# EAGLE schematic Digital & Analog Startup Board (EAGLE 6.3)
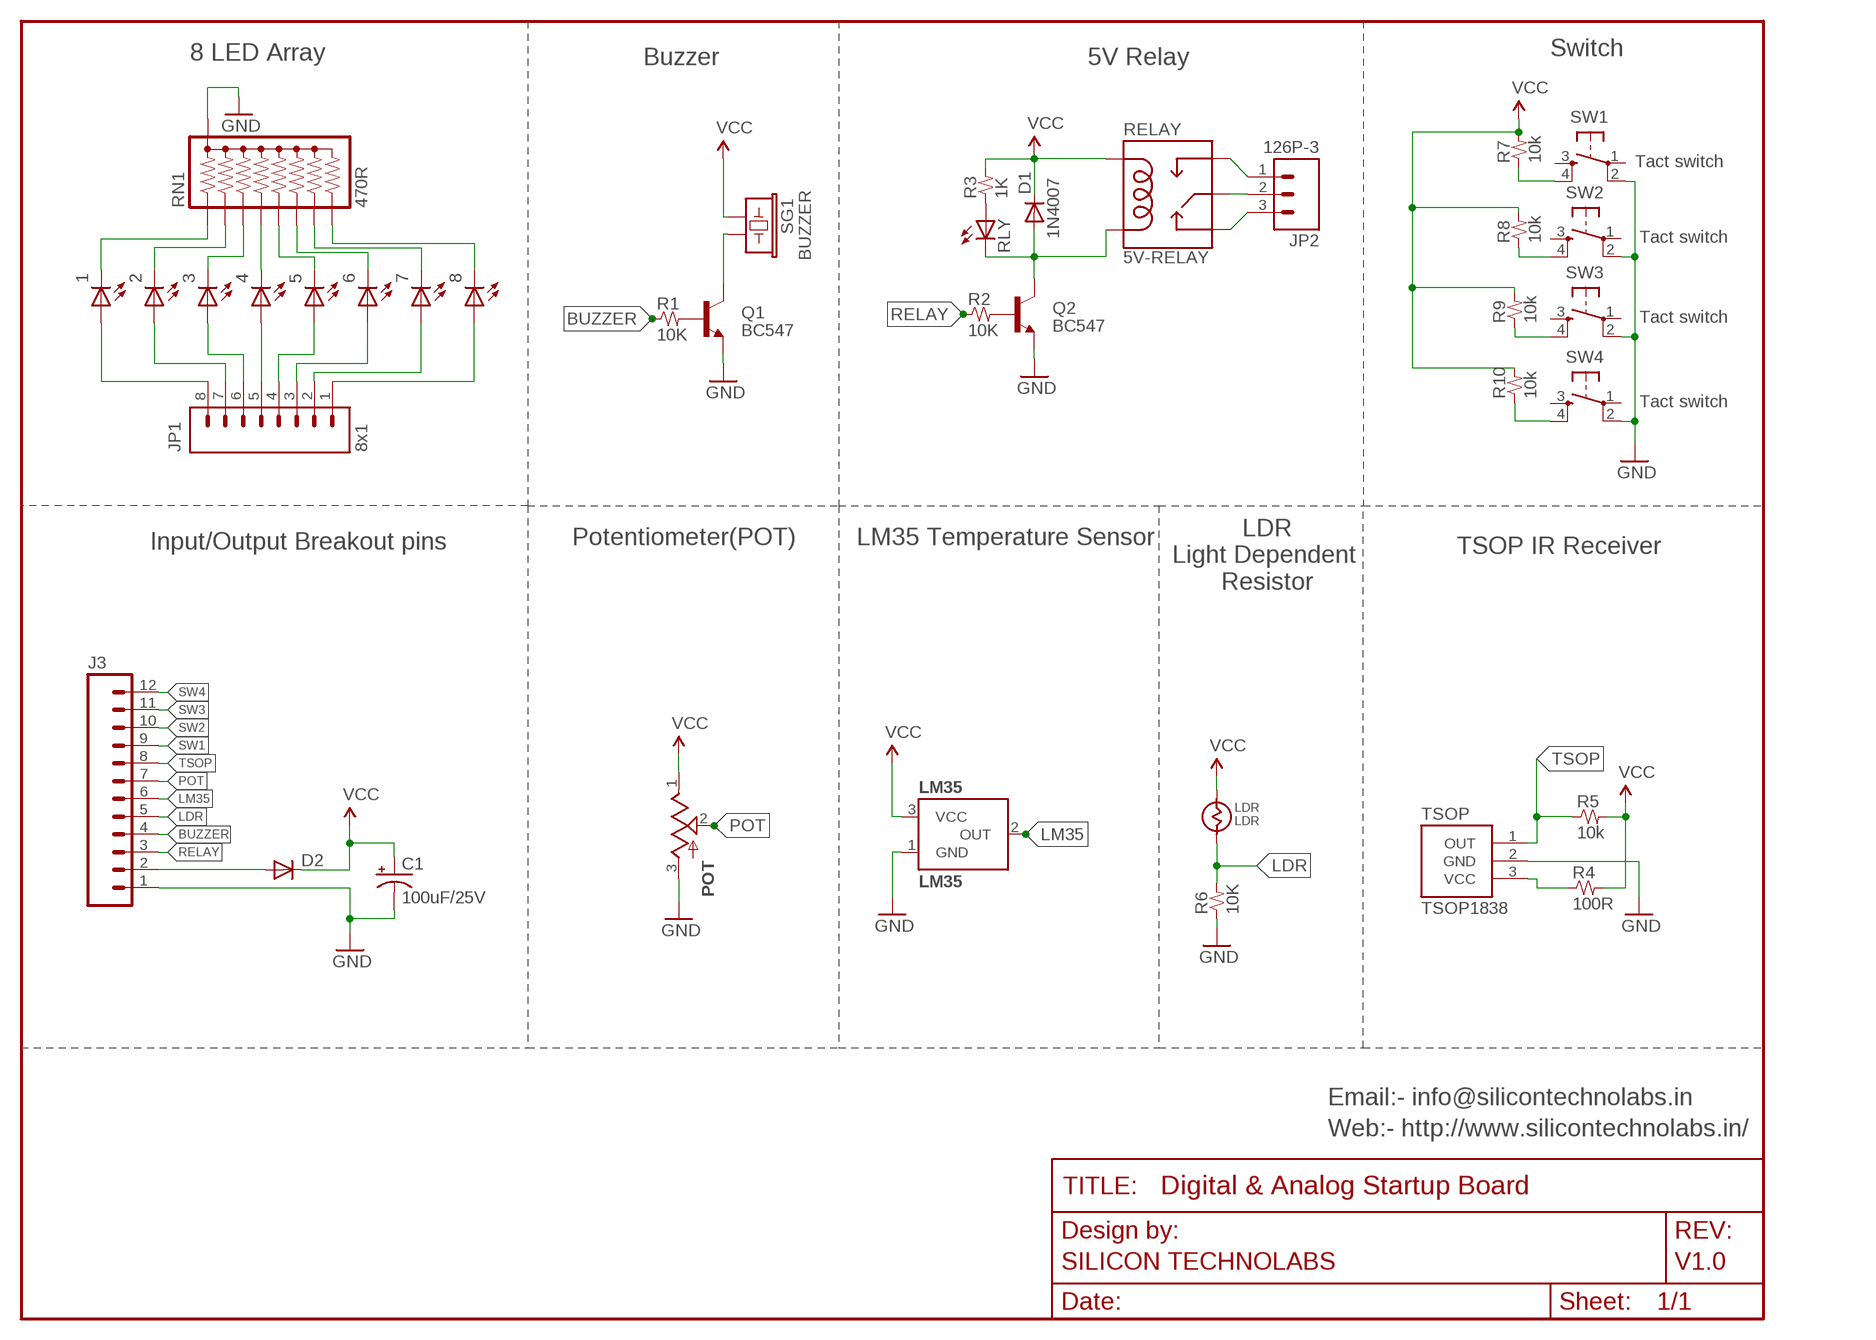
[diagram p0: schematic, sheet 1]

## Parts
1  LED3MM  [3MM]
2  LED3MM  [3MM]
3  LED3MM  [3MM]
4  LED3MM  [3MM]
5  LED3MM  [3MM]
5V-RELAY  RELAY  RELAYPTH5  [RELAY-LEONE]
6  LED3MM  [3MM]
7  LED3MM  [3MM]
8  LED3MM  [3MM]
C1  100uF/25V  CPOL100/25  [CPOL-RADIAL-100UF-25V]
D1  1N4007  [DIODE-1N4007]
D2  1N4007  [DIODE-1N4007]
J3  M12MACHINE-PIN_LOCK  [1X12_MACHINE-PIN-HEADER_LOCK.004]
JP1  8x1  M08  [1X08_LOCK]
JP2  126P-3  M03S  [1X03_SCREWTERM]
LDR  LDR  [LDR]
LM35  LM35  [TO-92]
POT  POTCH  [POT-CH]
Q1  BC547  [TO-92]
Q2  BC547  [TO-92]
R1  10K  RESISTOR-PTH-1/4W  [AXIAL-0.4]
R2  10K  RESISTOR-PTH-1/4W  [AXIAL-0.4]
R3  1K  RESISTOR-PTH-1/4W  [AXIAL-0.4]
R4  100R  RESISTOR-PTH-1/4W  [AXIAL-0.4]
R5  10k  RESISTOR-PTH-1/4W  [AXIAL-0.4]
R6  10K  RESISTOR-PTH-1/4W  [AXIAL-0.4]
R7  10k  RESISTOR-PTH-1/4W  [AXIAL-0.4]
R8  10k  RESISTOR-PTH-1/4W  [AXIAL-0.4]
R9  10k  RESISTOR-PTH-1/4W  [AXIAL-0.4]
R10  10k  RESISTOR-PTH-1/4W  [AXIAL-0.4]
RLY  LED3MM  [3MM]
RN1  470R  RPACK8  [RPACK-SIP-PTH-8-LP]
SG1  BUZZER  BUZZERPTH  [BUZZER-12MM]
SW1  Tact switch  TACTILE-SWITCH-5MM  [TACTILE-PTH]
SW2  Tact switch  TACTILE-SWITCH-5MM  [TACTILE-PTH]
SW3  Tact switch  TACTILE-SWITCH-5MM  [TACTILE-PTH]
SW4  Tact switch  TACTILE-SWITCH-5MM  [TACTILE-PTH]
TSOP  TSOP1838  BRM-2A18RA  [BRM-2508]

## Nets
BUZZER: J3.4 R1.P$1
COM: 5V-RELAY.C(MAIN) JP2.2
GND: C1.2(-) J3.1 LM35.1(GND) POT.3 Q1.1(E) Q2.1(E) R6.P$1 RN1.P$1 SW1.2 SW2.2 SW3.2 SW4.2 TSOP.2(GND)
LDR: J3.5 LDR.2 R6.P$2
LM35: J3.6 LM35.2(OUT)
N$1: 4.K(C) RN1.P$5
N$2: 1.K(C) RN1.P$2
N$3: 2.K(C) RN1.P$3
N$4: 3.K(C) RN1.P$4
N$5: 5.K(C) RN1.P$6
N$6: 6.K(C) RN1.P$7
N$7: 7.K(C) RN1.P$8
N$8: 8.K(C) RN1.P$9
N$9: 1.A JP1.8
N$10: 2.A JP1.7
N$11: 3.A JP1.6
N$12: 4.A JP1.5
N$13: 8.A JP1.1
N$14: 7.A JP1.2
N$16: 5.A JP1.4
N$17: Q1.2(B) R1.P$2
N$18: Q2.2(B) R2.P$2
N$19: R3.P$1 RLY.A
N$20: 5V-RELAY.1(COIL1) D1.A Q2.3(C) RLY.K(C)
N$22: 6.A JP1.3
N$23: Q1.3(C) SG1.-
N$25: R4.P$1 TSOP.3(VCC)
NC: 5V-RELAY.NC JP2.3
NO: 5V-RELAY.NO JP2.1
POT: J3.7 POT.2
RELAY: J3.3 R2.P$1
SW1: J3.9 R7.P$1 SW1.4
SW2: J3.10 R8.P$1 SW2.4
SW3: J3.11 R9.P$1 SW3.4
SW4: J3.12 R10.P$1 SW4.4
TSOP: J3.8 R5.P$1 TSOP.1(OUT)
VCC: 5V-RELAY.2(COIL2) C1.1(+) D1.C D2.C LDR.1 LM35.3(VCC) POT.1 R3.P$2 R4.P$2 R5.P$2 R7.P$2 R8.P$2 R9.P$2 R10.P$2 SG1.+
VDD: D2.A J3.2
Unconnected: SW1.1 SW1.3 SW2.1 SW2.3 SW3.1 SW3.3 SW4.1 SW4.3

## Notes on the sheet
- 8 LED Array | Switch
- Buzzer | 5V Relay
- Input/Output Breakout pins | Potentiometer(POT) | LM35 Temperature Sensor
- TSOP IR Receiver
- LDR
  Light Dependent 
         Resistor
- Email:- info@silicontechnolabs.in
- Web:- http://www.silicontechnolabs.in/
- V1.0

## Library data of the parts
1-8 RLY = SiliconTechnolabs:LED: LED
5V-RELAY = SparkFun-Electromechanical:RELAY: SPDT relay (COM-00101)
C1 = SiliconTechnolabs:CPOL: Capacitor
D1 D2 = SiliconTechnolabs:1N4007
J3 = SparkFun-Connectors:M12: Header 12 Standard 12-pin 0.1" header. Use with straight break away headers (SKU : PRT-00116), right angle break away headers (PRT-00553), swiss pins (PRT-00743), machine pins (PRT-00117), and female headers (PRT-00115).
JP1 = SiliconTechnolabs:M08: M08_POLARISED_CONNECTOR M08
JP2 = SiliconTechnolabs:M03: 3 Pin Connector
LDR = SiliconTechnolabs:LDR: LDR
LM35 = SiliconTechnolabs:LM35: temperature sensor
POT = SiliconTechnolabs:POT: Trimpot pot variable resistor
Q1 Q2 = SiliconTechnolabs:BC547: BC547
R1-R10 = SiliconTechnolabs:RESISTOR: Resistor res
RN1 = SiliconTechnolabs Yatin Laptop:RPACK8: Resistor
SG1 = SparkFun-Electromechanical:BUZZER: Buzzer 12mm Spark Fun Electronics SKU : Comp-Buzzer
SW1-SW4 = SiliconTechnolabs:TACTILE-SWITCH: switch
TSOP = SparkFun-Sensors:BRM-2A18: BRM-2A18 IR receiver.